# EAGLE design ioboard (EAGLE 7.2.0)
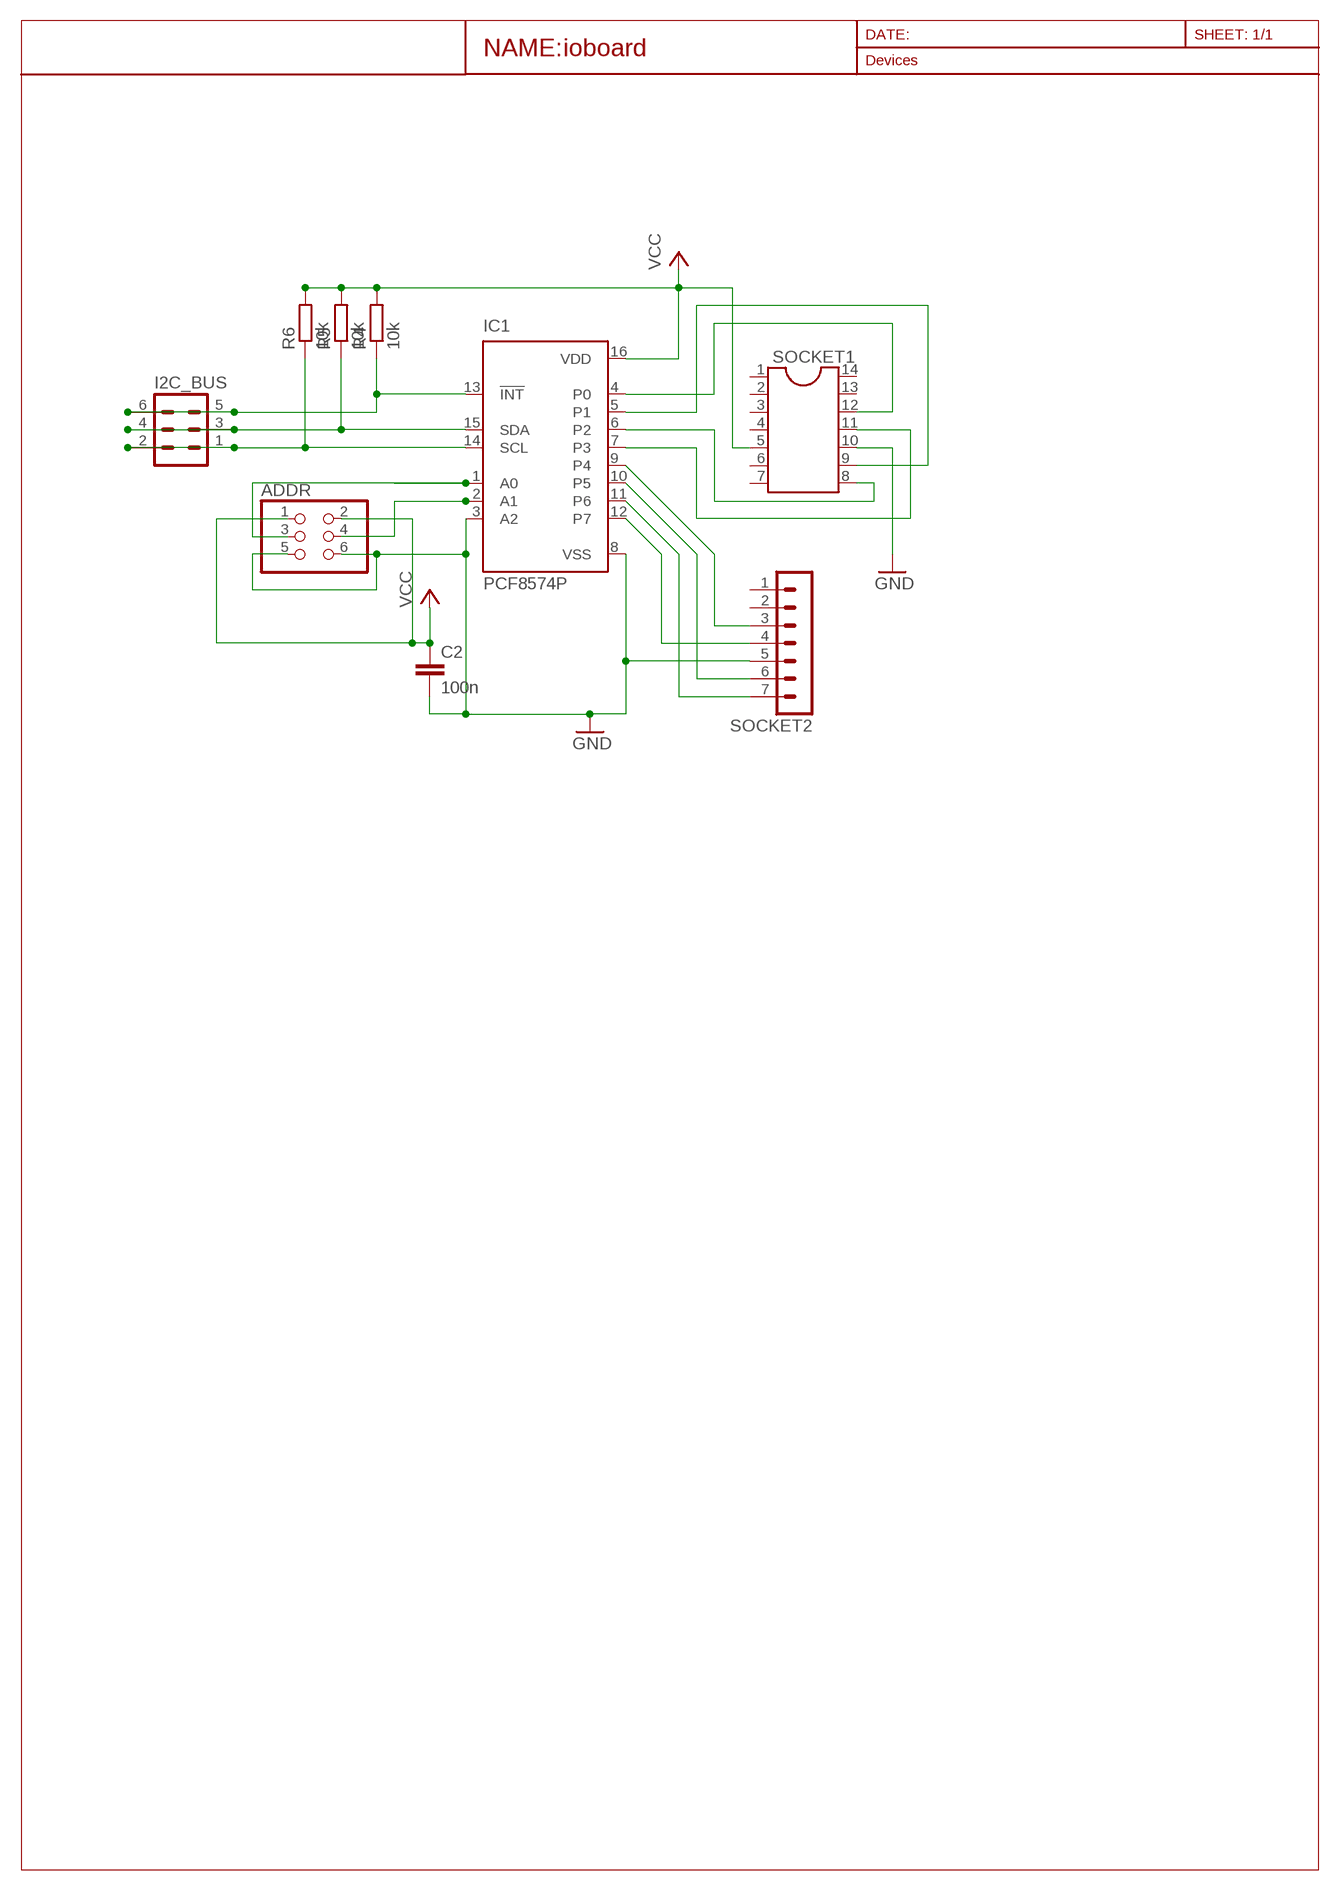
[diagram p0: schematic, sheet 1]

## Parts
ADDR  PINHD-2X3  [2X03]
C2  100n  C-EU050-024X044  [C050-024X044]
I2C_BUS  MA03-2  [MA03-2]
IC1  PCF8574P  [DIL16]
R4  10k  R-EU_0207/10  [0207/10]
R5  10k  R-EU_0207/10  [0207/10]
R6  10k  R-EU_0207/10  [0207/10]
SOCKET1  DIL14S  [SOCKET-14]
SOCKET2  MA07-1  [MA07-1]

## Nets
GND: ADDR.5 ADDR.6 C2.2 IC1.3(A2) IC1.8(VSS) SOCKET1.10 SOCKET2.5
N$1: IC1.4(P0) SOCKET1.12
N$2: IC1.5(P1) SOCKET1.9
N$3: IC1.6(P2) SOCKET1.8
N$4: IC1.7(P3) SOCKET1.11
N$5: IC1.9(P4) SOCKET2.3
N$6: IC1.10(P5) SOCKET2.6
N$7: IC1.11(P6) SOCKET2.7
N$8: IC1.12(P7) SOCKET2.4
N$9: I2C_BUS.5 I2C_BUS.6 IC1.13(!INT) R4.1
N$10: I2C_BUS.1 I2C_BUS.2 IC1.14(SCL) R6.1
N$11: ADDR.3 IC1.1(A0)
N$15: ADDR.4 IC1.2(A1)
N$16: I2C_BUS.3 I2C_BUS.4 IC1.15(SDA) R5.1
VCC: ADDR.1 ADDR.2 C2.1 IC1.16(VDD) R4.2 R5.2 R6.2 SOCKET1.5
Unconnected: SOCKET1.1 SOCKET1.2 SOCKET1.3 SOCKET1.4 SOCKET1.6 SOCKET1.7 SOCKET1.13 SOCKET1.14 SOCKET2.1 SOCKET2.2

## Library data of the parts
ADDR = pinhead:PINHD-2X3: PIN HEADER
C2 = resistor:C-EU: CAPACITOR, European symbol
I2C_BUS = con-lstb:MA03-2: PIN HEADER; OC_FARNELL: unknown; OC_NEWARK: unknown
IC1 = micro-philips:PCF8574: I2C-Bus Remote 8-bit I/O expander http://www.semiconductors.philips.com/acrobat_download/datasheets/PCF8574_4.pdf; MPN: PCF8574PN; OC_FARNELL: 204020; OC_NEWARK: 11N8515
R4-R6 = resistor:R-EU_: RESISTOR, European symbol
SOCKET1 = ic-package:DIL14: Dual In Line / Socket
SOCKET2 = con-lstb:MA07-1: PIN HEADER; OC_FARNELL: unknown; OC_NEWARK: unknown

## Board
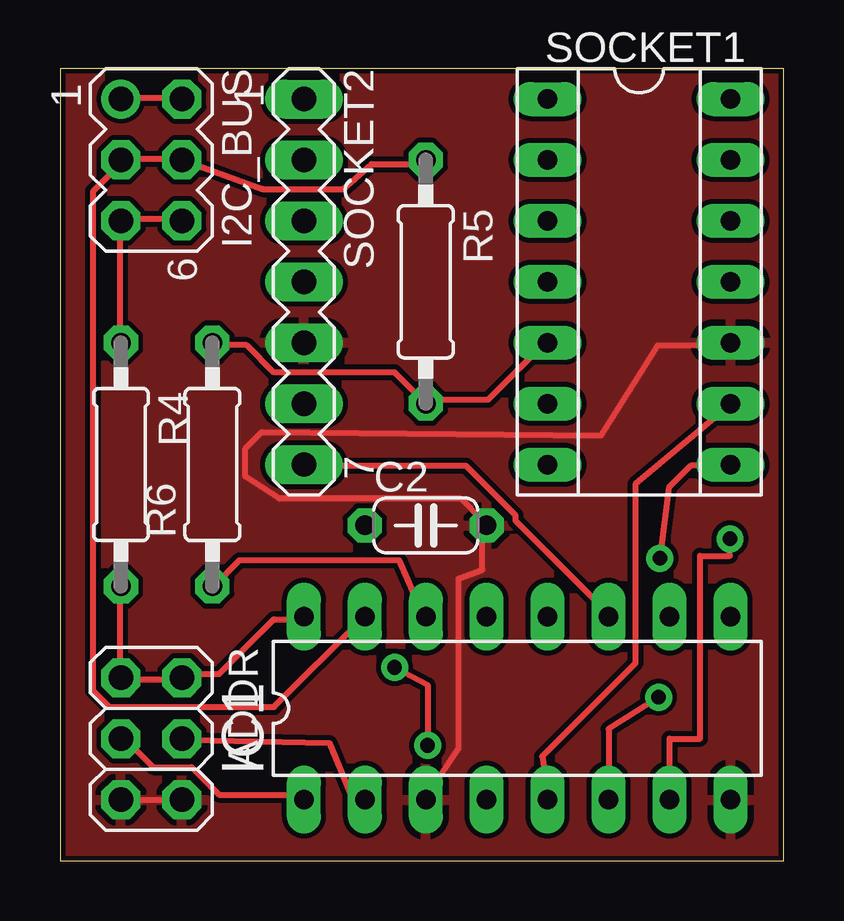
[diagram p1: board, top side]
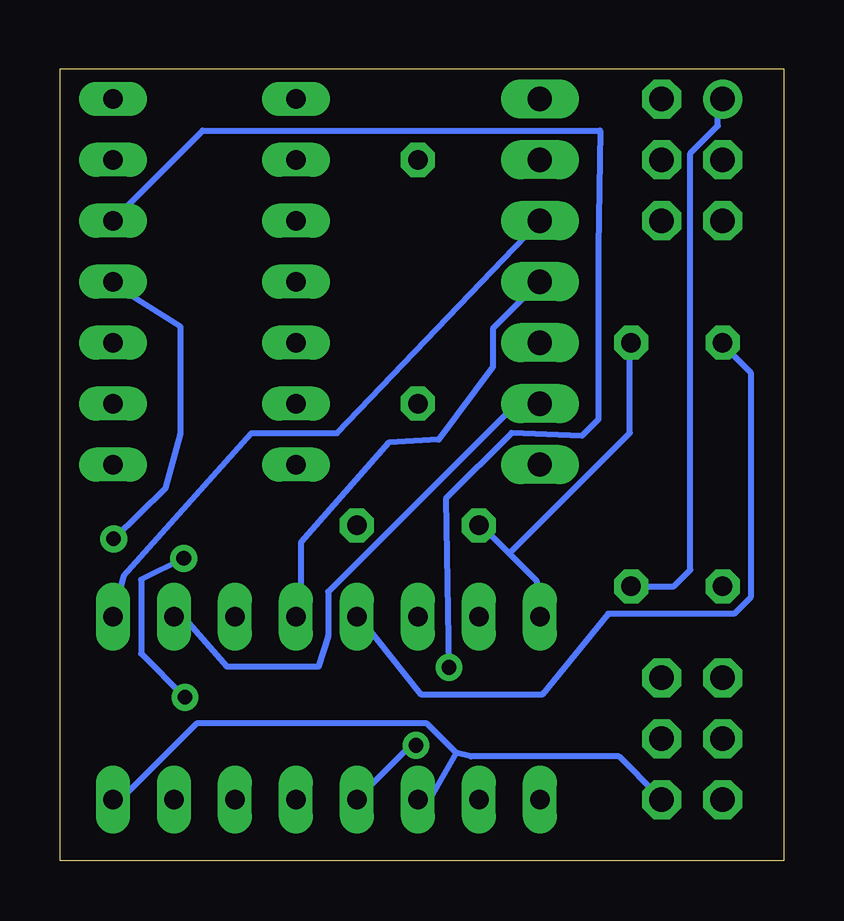
[diagram p2: board, bottom side, seen from below]

Size 30.15 x 33.01 mm. Coordinates in mm from the lower left corner, seen from the top.
Outline: 0,0 30.15,0 30.15,33.01 0,33.01 0,0
Copper layers (1*16): Top 0.035mm / dielectric 1.5mm / Bottom 0.035mm
Design rules "SparkFun": minimum track width 8mil, minimum drill 20mil, track to track 8mil, track to pad 8mil, pad to pad 8mil, via to via 8mil, smd to smd 8mil, copper to edge 8mil, drill to drill 8mil, minimum pad ring 12mil, minimum via ring 10mil, stop-mask expansion 4mil, vias tented up to drill 20mil, thermal gap 10mil

### Footprints (pad centres in the part's own frame; a part is rotated, then mirrored left to right if it is on the bottom)
2X03 = drill 1.016 octagon: 1 -2.54,-1.27; 2 -2.54,1.27; 3 0,-1.27; 4 0,1.27; 5 2.54,-1.27; 6 2.54,1.27
C050-024X044 = drill 0.813 octagon: 1 -2.54,0; 2 2.54,0
MA03-2 = drill 1.016: 1 -2.54,-1.27 | drill 1.016 octagon: 2 -2.54,1.27; 3 0,-1.27; 4 0,1.27; 5 2.54,-1.27; 6 2.54,1.27
DIL16 = drill 0.813 long: 1 -8.89,-3.81; 2 -6.35,-3.81; 3 -3.81,-3.81; 4 -1.27,-3.81; 5 1.27,-3.81; 6 3.81,-3.81; 7 6.35,-3.81; 8 8.89,-3.81; 9 8.89,3.81; 10 6.35,3.81; 11 3.81,3.81; 12 1.27,3.81; 13 -1.27,3.81; 14 -3.81,3.81; 15 -6.35,3.81; 16 -8.89,3.81
0207/10 = drill 0.813 octagon: 1 -5.08,0; 2 5.08,0
SOCKET-14 = drill 0.813 long: 1 -7.62,-3.81; 2 -5.08,-3.81; 3 -2.54,-3.81; 4 0,-3.81; 5 2.54,-3.81; 6 5.08,-3.81; 7 7.62,-3.81; 8 7.62,3.81; 9 5.08,3.81; 10 2.54,3.81; 11 0,3.81; 12 -2.54,3.81; 13 -5.08,3.81; 14 -7.62,3.81
MA07-1 = drill 1.016 long: 1 -7.62,0; 2 -5.08,0; 3 -2.54,0; 4 0,0; 5 2.54,0; 6 5.08,0; 7 7.62,0

### Placement (x,y rotation side)
ADDR  3.81,5.08 270 top
C2  15.24,13.97 0 top
I2C_BUS  3.81,29.21 270 top
IC1  19.05,6.35 0 top
R4  2.54,16.51 270 top
R5  15.24,24.13 270 top
R6  6.35,16.51 90 top
SOCKET1  24.13,24.13 270 top
SOCKET2  10.16,24.13 270 top

### Tracks (layer width: path | path; a pad name or v marks a point on that pad's centre or on a via)
GND
  Top 0.254: IC1.3 15.32,2.74 16.61,4.67 16.61,11.76 17.6,12.12 17.6,13.95 C2.2 17.6,14.17 16.69,15.09 9.14,15.09 7.72,16 7.72,17.17 8.41,17.86 22.55,17.73 24.92,21.49 27.89,21.49 SOCKET1.10 | ADDR.5 2.74,2.52 5.03,2.52 ADDR.6
  Bottom 0.254: 13.64,4.5 13.03,4.34 6.86,4.34 5.26,2.74 ADDR.6 | 13.64,4.5 14.63,2.74 15.09,2.74 IC1.3 | 13.64,4.5 14.86,5.71 24.46,5.71 27.43,2.74 27.89,2.74 IC1.8
  pour Top: 0,33.02 30.48,33.02 30.48,0 0,0
N$1  (via drill 0.61)
  Top 0.254: v15.32,4.8 15.32,7.32 v13.95,8.05
  Bottom 0.254: v15.32,4.8 15.54,4.8 17.6,2.74 IC1.4 | v13.95,8.05 14.07,15.09 11.33,17.83 8.41,17.7 7.72,18.39 7.72,25.55 7.64,30.43 24.21,30.43 27.89,26.75 SOCKET1.12
N$2
  Top 0.254: IC1.5 20.34,2.74 20.09,4.34 23.98,8.23 23.98,15.7 27.89,18.97 SOCKET1.9
N$3  (via drill 0.61)
  Top 0.254: IC1.6 22.86,5.49 v24.94,6.81 | v24.99,12.6 25.38,15.54 26.29,16.46 27.89,16.46 SOCKET1.8
  Bottom 0.254: v24.94,6.81 26.77,8.64 26.77,11.71 v24.99,12.6
N$4  (via drill 0.61)
  Top 0.254: IC1.7 25.6,2.74 25.4,2.74 25.4,5.08 26.67,5.08 26.67,12.7 27.91,12.7 v27.91,13.41
  Bottom 0.254: v27.91,13.41 25.76,15.52 25.15,17.78 25.15,22.28 27.89,24 SOCKET1.11
N$5
  Bottom 0.254: IC1.9 27.89,10.29 27.51,11.84 22.17,17.8 18.62,17.8 10.29,26.52 SOCKET2.3
N$6
  Bottom 0.254: IC1.10 25.38,10.06 24.92,10.06 23.19,8.08 19.38,8.08 18.97,9.37 18.97,11.2 11.2,18.97 10.29,18.97 SOCKET2.6
N$7
  Top 0.254: IC1.11 22.86,10.29 18.97,14.17 18.97,14.4 16.92,16.46 10.29,16.46 SOCKET2.7
N$8
  Bottom 0.254: SOCKET2.4 12.12,22.17 12.12,20.57 14.38,17.55 16.46,17.42 20.12,13.26 20.12,10.29 IC1.12
N$9
  Top 0.254: I2C_BUS.6 5.03,26.75 2.74,26.75 I2C_BUS.5 2.52,26.52 2.52,21.72 R4.1
  Bottom 0.254: IC1.13 17.6,10.06 15.09,6.91 10.06,6.91 7.32,10.29 2.06,10.29 1.37,10.97 1.37,20.34 2.52,21.49 R4.1
N$10
  Top 0.254: I2C_BUS.1 2.74,31.77 5.03,31.77 I2C_BUS.2 | IC1.14 15.09,10.29 14.12,12.52 7.49,12.52 6.4,11.43 R6.1
  Bottom 0.254: R6.1 4.57,11.43 3.89,12.12 3.89,29.49 2.74,30.63 2.74,31.55 I2C_BUS.1
N$11
  Top 0.254: IC1.1 10.06,2.74 6.63,2.74 5.49,3.89 3.89,3.89 2.74,5.03 ADDR.3
N$15
  Top 0.254: IC1.2 12.57,2.74 12.12,2.74 11.23,4.9 5.26,5.03 ADDR.4
N$16
  Top 0.254: R5.1 15.09,29.03 12.98,29.03 11.81,27.99 8.46,27.99 I2C_BUS.4 5.03,29.26 2.74,29.26 I2C_BUS.3 2.52,29.03 1.37,27.89 1.37,7.09 2.06,6.4 8.91,6.4 12.57,10.06 IC1.15
VCC
  Top 0.254: SOCKET1.5 20.12,21.49 17.83,19.2 15.32,19.2 R5.2 13.95,20.34 8.91,20.34 7.77,21.49 6.4,21.49 R6.2 | R4.2 2.52,11.43 2.52,7.77 ADDR.1 2.74,7.54 5.03,7.54 ADDR.2 5.26,7.77 6.63,7.77 8.91,10.06 10.06,10.06 IC1.16
  Bottom 0.254: 11.43,12.8 12.57,13.95 C2.1 | 11.43,12.8 10.29,11.66 10.29,10.29 IC1.16 | 11.43,12.8 6.4,17.83 6.4,21.49 R6.2